# Altium schematic sheet [03] - OV2640.SchDoc
size A3; DocumentNumber: 2; SheetNumber: 2; SheetTotal: 4
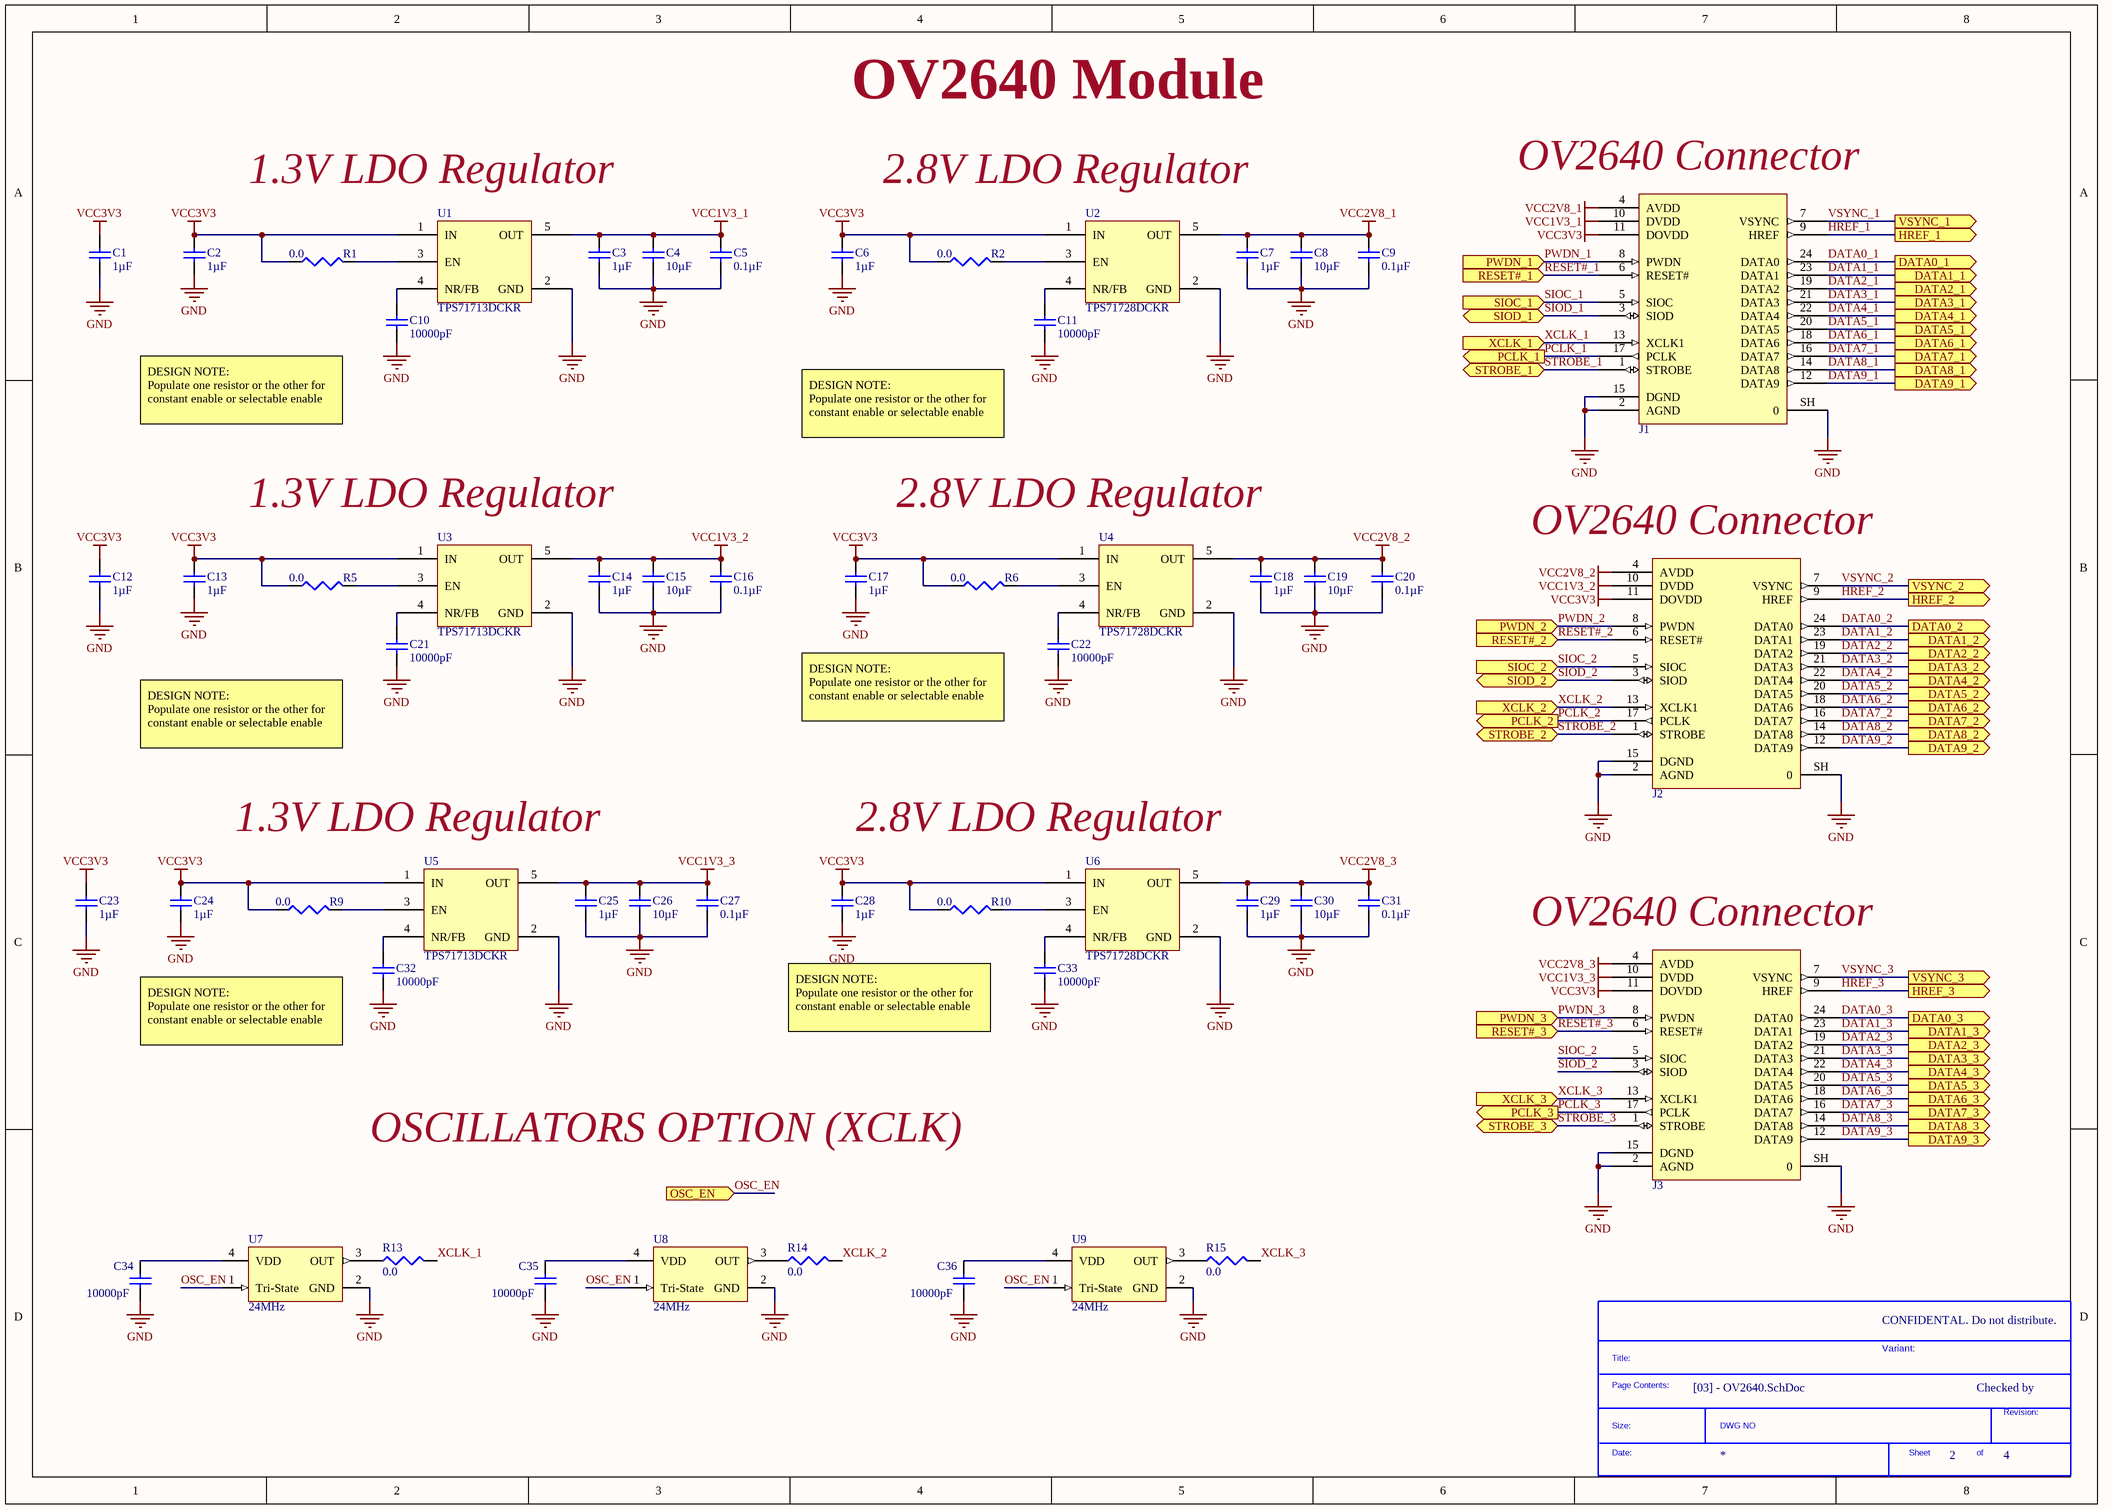
[diagram p0: [03] - OV2640.SchDoc]

## Parts
*  SDTitleBlock  (value not drawn)  (graphical)
C1  Capacitance: 1µF  [CAP-0603]  (hidden comment: GRM188R71C105KA12D)
C2  Capacitance: 1µF  [CAP-0603]  (hidden comment: GRM188R71C105KA12D)
C3  Capacitance: 1µF  [CAP-0603]  (hidden comment: GRM188R71C105KA12D)
C4  Capacitance: 10µF  [CAP-0805]  (hidden comment: GRM21BR61E106KA73L)
C5  Capacitance: 0.1µF  [CAP-0603]  (hidden comment: GRM188R71C104KA01D)
C6  Capacitance: 1µF  [CAP-0603]  (hidden comment: GRM188R71C105KA12D)
C7  Capacitance: 1µF  [CAP-0603]  (hidden comment: GRM188R71C105KA12D)
C8  Capacitance: 10µF  [CAP-0805]  (hidden comment: GRM21BR61E106KA73L)
C9  Capacitance: 0.1µF  [CAP-0603]  (hidden comment: GRM188R71C104KA01D)
C10  Capacitance: 10000pF  [CAP-0603]  (hidden comment: GRM188R71E103KA01D)
C11  Capacitance: 10000pF  [CAP-0603]  (hidden comment: GRM188R71E103KA01D)
C12  Capacitance: 1µF  [CAP-0603]  (hidden comment: GRM188R71C105KA12D)
C13  Capacitance: 1µF  [CAP-0603]  (hidden comment: GRM188R71C105KA12D)
C14  Capacitance: 1µF  [CAP-0603]  (hidden comment: GRM188R71C105KA12D)
C15  Capacitance: 10µF  [CAP-0805]  (hidden comment: GRM21BR61E106KA73L)
C16  Capacitance: 0.1µF  [CAP-0603]  (hidden comment: GRM188R71C104KA01D)
C17  Capacitance: 1µF  [CAP-0603]  (hidden comment: GRM188R71C105KA12D)
C18  Capacitance: 1µF  [CAP-0603]  (hidden comment: GRM188R71C105KA12D)
C19  Capacitance: 10µF  [CAP-0805]  (hidden comment: GRM21BR61E106KA73L)
C20  Capacitance: 0.1µF  [CAP-0603]  (hidden comment: GRM188R71C104KA01D)
C21  Capacitance: 10000pF  [CAP-0603]  (hidden comment: GRM188R71E103KA01D)
C22  Capacitance: 10000pF  [CAP-0603]  (hidden comment: GRM188R71E103KA01D)
C23  Capacitance: 1µF  [CAP-0603]  (hidden comment: GRM188R71C105KA12D)
C24  Capacitance: 1µF  [CAP-0603]  (hidden comment: GRM188R71C105KA12D)
C25  Capacitance: 1µF  [CAP-0603]  (hidden comment: GRM188R71C105KA12D)
C26  Capacitance: 10µF  [CAP-0805]  (hidden comment: GRM21BR61E106KA73L)
C27  Capacitance: 0.1µF  [CAP-0603]  (hidden comment: GRM188R71C104KA01D)
C28  Capacitance: 1µF  [CAP-0603]  (hidden comment: GRM188R71C105KA12D)
C29  Capacitance: 1µF  [CAP-0603]  (hidden comment: GRM188R71C105KA12D)
C30  Capacitance: 10µF  [CAP-0805]  (hidden comment: GRM21BR61E106KA73L)
C31  Capacitance: 0.1µF  [CAP-0603]  (hidden comment: GRM188R71C104KA01D)
C32  Capacitance: 10000pF  [CAP-0603]  (hidden comment: GRM188R71E103KA01D)
C33  Capacitance: 10000pF  [CAP-0603]  (hidden comment: GRM188R71E103KA01D)
C34  Capacitance: 10000pF  [CAP-0603]  (hidden comment: GRM188R71E103KA01D)
C35  Capacitance: 10000pF  [CAP-0603]  (hidden comment: GRM188R71E103KA01D)
C36  Capacitance: 10000pF  [CAP-0603]  (hidden comment: GRM188R71E103KA01D)
J1  OV2640 FFC  [ov2640FSL]  (value not drawn)
J2  OV2640 FFC  [ov2640FSL]  (value not drawn)
J3  OV2640 FFC  [ov2640FSL]  (value not drawn)
R1  Resistance (Ohms): 0.0  [R0603]  (hidden comment: ERJ-3GEY0R00V)
R2  Resistance (Ohms): 0.0  [R0603]  (hidden comment: ERJ-3GEY0R00V)
R5  Resistance (Ohms): 0.0  [R0603]  (hidden comment: ERJ-3GEY0R00V)
R6  Resistance (Ohms): 0.0  [R0603]  (hidden comment: ERJ-3GEY0R00V)
R9  Resistance (Ohms): 0.0  [R0603]  (hidden comment: ERJ-3GEY0R00V)
R10  Resistance (Ohms): 0.0  [R0603]  (hidden comment: ERJ-3GEY0R00V)
R13  Resistance (Ohms): 0.0  [R0603]  (hidden comment: ERJ-3GEY0R00V)
R14  Resistance (Ohms): 0.0  [R0603]  (hidden comment: ERJ-3GEY0R00V)
R15  Resistance (Ohms): 0.0  [R0603]  (hidden comment: ERJ-3GEY0R00V)
U1  TPS71713DCKR  [SOT65P210X110-5N]
U2  TPS71728DCKR  [SOT65P210X110-5N]
U3  TPS71713DCKR  [SOT65P210X110-5N]
U4  TPS71728DCKR  [SOT65P210X110-5N]
U5  TPS71713DCKR  [SOT65P210X110-5N]
U6  TPS71728DCKR  [SOT65P210X110-5N]
U7  24MHz  [OSC 4-SMD]
U8  24MHz  [OSC 4-SMD]
U9  24MHz  [OSC 4-SMD]

## Ports
DATA0_1 (out), DATA0_2 (out), DATA0_3 (out), DATA1_1 (out), DATA1_2 (out), DATA1_3 (out), DATA2_1 (out), DATA2_2 (out), DATA2_3 (out), DATA3_1 (out), DATA3_2 (out), DATA3_3 (out), DATA4_1 (out), DATA4_2 (out), DATA4_3 (out), DATA5_1 (out), DATA5_2 (out), DATA5_3 (out), DATA6_1 (out), DATA6_2 (out), DATA6_3 (out), DATA7_1 (out), DATA7_2 (out), DATA7_3 (out), DATA8_1 (out), DATA8_2 (out), DATA8_3 (out), DATA9_1 (out), DATA9_2 (out), DATA9_3 (out), HREF_1 (out), HREF_2 (out), HREF_3 (out), OSC_EN (in), PCLK_1 (out), PCLK_2 (out), PCLK_3 (out), PWDN_1 (in), PWDN_2 (in), PWDN_3 (in), RESET#_1 (in), RESET#_2 (in), RESET#_3 (in), SIOC_1 (in), SIOC_2 (in), SIOD_1 (bidir), SIOD_2 (bidir), STROBE_1 (bidir), STROBE_2 (bidir), STROBE_3 (bidir), VSYNC_1 (out), VSYNC_2 (out), VSYNC_3 (out), XCLK_1 (in), XCLK_2 (in), XCLK_3 (in)

## Nets
GND: C1.2 C2.2 C3.2 C4.2 C5.2 C6.2 C7.2 C8.2 C9.2 C10.2 C11.2 C12.2 C13.2 C14.2 C15.2 C16.2 C17.2 C18.2 C19.2 C20.2 C21.2 C22.2 C23.2 C24.2 C25.2 C26.2 C27.2 C28.2 C29.2 C30.2 C31.2 C32.2 C33.2 C34.2 C35.2 C36.2 J1.2(AGND) J1.15(DGND) J1.SH(0) J2.2(AGND) J2.15(DGND) J2.SH(0) J3.2(AGND) J3.15(DGND) J3.SH(0) U1.2(GND) U2.2(GND) U3.2(GND) U4.2(GND) U5.2(GND) U6.2(GND) U7.2(GND) U8.2(GND) U9.2(GND)
VCC1V3_1: C3.1 C4.1 C5.1 J1.10(DVDD) U1.5(OUT)
VCC1V3_2: C14.1 C15.1 C16.1 J2.10(DVDD) U3.5(OUT)
VCC1V3_3: C25.1 C26.1 C27.1 J3.10(DVDD) U5.5(OUT)
VCC2V8_1: C7.1 C8.1 C9.1 J1.4(AVDD) U2.5(OUT)
VCC2V8_2: C18.1 C19.1 C20.1 J2.4(AVDD) U4.5(OUT)
VCC2V8_3: C29.1 C30.1 C31.1 J3.4(AVDD) U6.5(OUT)
VCC3V3: C1.1 C2.1 C6.1 C12.1 C13.1 C17.1 C23.1 C24.1 C28.1 J1.11(DOVDD) J2.11(DOVDD) J3.11(DOVDD) R1.1 R2.1 R5.1 R6.1 R9.1 R10.1 U1.1(IN) U2.1(IN) U3.1(IN) U4.1(IN) U5.1(IN) U6.1(IN)
DATA0_1: J1.24(DATA0) ; port DATA0_1
DATA0_2: J2.24(DATA0) ; port DATA0_2
DATA0_3: J3.24(DATA0) ; port DATA0_3
DATA1_1: J1.23(DATA1) ; port DATA1_1
DATA1_2: J2.23(DATA1) ; port DATA1_2
DATA1_3: J3.23(DATA1) ; port DATA1_3
DATA2_1: J1.19(DATA2) ; port DATA2_1
DATA2_2: J2.19(DATA2) ; port DATA2_2
DATA2_3: J3.19(DATA2) ; port DATA2_3
DATA3_1: J1.21(DATA3) ; port DATA3_1
DATA3_2: J2.21(DATA3) ; port DATA3_2
DATA3_3: J3.21(DATA3) ; port DATA3_3
DATA4_1: J1.22(DATA4) ; port DATA4_1
DATA4_2: J2.22(DATA4) ; port DATA4_2
DATA4_3: J3.22(DATA4) ; port DATA4_3
DATA5_1: J1.20(DATA5) ; port DATA5_1
DATA5_2: J2.20(DATA5) ; port DATA5_2
DATA5_3: J3.20(DATA5) ; port DATA5_3
DATA6_1: J1.18(DATA6) ; port DATA6_1
DATA6_2: J2.18(DATA6) ; port DATA6_2
DATA6_3: J3.18(DATA6) ; port DATA6_3
DATA7_1: J1.16(DATA7) ; port DATA7_1
DATA7_2: J2.16(DATA7) ; port DATA7_2
DATA7_3: J3.16(DATA7) ; port DATA7_3
DATA8_1: J1.14(DATA8) ; port DATA8_1
DATA8_2: J2.14(DATA8) ; port DATA8_2
DATA8_3: J3.14(DATA8) ; port DATA8_3
DATA9_1: J1.12(DATA9) ; port DATA9_1
DATA9_2: J2.12(DATA9) ; port DATA9_2
DATA9_3: J3.12(DATA9) ; port DATA9_3
HREF_1: J1.9(HREF) ; port HREF_1
HREF_2: J2.9(HREF) ; port HREF_2
HREF_3: J3.9(HREF) ; port HREF_3
OSC_EN: U7.1(Tri-State) U8.1(Tri-State) U9.1(Tri-State) ; port OSC_EN
PCLK_1: J1.17(PCLK) ; port PCLK_1
PCLK_2: J2.17(PCLK) ; port PCLK_2
PCLK_3: J3.17(PCLK) ; port PCLK_3
PWDN_1: J1.8(PWDN) ; port PWDN_1
PWDN_2: J2.8(PWDN) ; port PWDN_2
PWDN_3: J3.8(PWDN) ; port PWDN_3
RESET#_1: J1.6(RESET#) ; port RESET#_1
RESET#_2: J2.6(RESET#) ; port RESET#_2
RESET#_3: J3.6(RESET#) ; port RESET#_3
SIOC_1: J1.5(SIOC) ; port SIOC_1
SIOC_2: J2.5(SIOC) J3.5(SIOC) ; port SIOC_2
SIOD_1: J1.3(SIOD) ; port SIOD_1
SIOD_2: J2.3(SIOD) J3.3(SIOD) ; port SIOD_2
STROBE_1: J1.1(STROBE) ; port STROBE_1
STROBE_2: J2.1(STROBE) ; port STROBE_2
STROBE_3: J3.1(STROBE) ; port STROBE_3
VSYNC_1: J1.7(VSYNC) ; port VSYNC_1
VSYNC_2: J2.7(VSYNC) ; port VSYNC_2
VSYNC_3: J3.7(VSYNC) ; port VSYNC_3
XCLK_1: J1.13(XCLK1) R13.2 ; port XCLK_1
XCLK_2: J2.13(XCLK1) R14.2 ; port XCLK_2
XCLK_3: J3.13(XCLK1) R15.2 ; port XCLK_3
NetC10_1: C10.1 U1.4(NR/FB)
NetC11_1: C11.1 U2.4(NR/FB)
NetC21_1: C21.1 U3.4(NR/FB)
NetC22_1: C22.1 U4.4(NR/FB)
NetC32_1: C32.1 U5.4(NR/FB)
NetC33_1: C33.1 U6.4(NR/FB)
NetC34_1: C34.1 U7.4(VDD)
NetC35_1: C35.1 U8.4(VDD)
NetC36_1: C36.1 U9.4(VDD)
NetR1_2: R1.2 U1.3(EN)
NetR2_2: R2.2 U2.3(EN)
NetR5_2: R5.2 U3.3(EN)
NetR6_2: R6.2 U4.3(EN)
NetR9_2: R9.2 U5.3(EN)
NetR10_2: R10.2 U6.3(EN)
NetR13_1: R13.1 U7.3(OUT)
NetR14_1: R14.1 U8.3(OUT)
NetR15_1: R15.1 U9.3(OUT)

## Notes on the sheet
- OV2640 Module
- (near J1) OV2640 Connector
- 1.3V LDO Regulator
- 2.8V LDO Regulator
- DESIGN NOTE:
  Populate one resistor or the other for constant enable or selectable enable
- (near J2) OV2640 Connector
- (near J3) OV2640 Connector
- (near C32) DESIGN NOTE:
  Populate one resistor or the other for constant enable or selectable enable
- OSCILLATORS OPTION (XCLK)
- CONFIDENTAL. Do not distribute.
- Variant:
- Checked by
- (in symbol SDTitleBlock) Title:; Page Contents:; Revision:; Size:; DWG NO; Date:; Sheet; of

## Library data of the parts
C1-C3 C6 C7 C12-C14 C17 C18 C23-C25 C28 C29 = GRM188R71C105KA12D: CAP CER 1UF 16V X7R 0603; Manufacturer: Murata Electronics North America; Tolerance: ±10%; Supplier 1: Digi-Key; Manufacturer Part Number: GRM188R71C105KA12D; RoHS: RoHS Compliant; Category: Capacitors; Stock 1: 819049; Pricing 1: 1=0.1, 10=0.073, 50=0.0396, 100=0.0336, 250=0.02744, 500=0.02348, 1000=0.0183 (USD); Packaging: Cut Tape (CT); Voltage - Rated: 16V; Temperature Coefficient: X7R; Mounting Type: Surface Mount, MLCC; Operating Temperature: -55°C ~ 125°C; Applications: General Purpose; Ratings: -; Package / Case: 0603 (1608 Metric); Size / Dimension: 0.063" L x 0.031" W (1.60mm x 0.80mm); Height - Seated (Max): -; Thickness (Max): 0.035" (0.90mm); Lead Spacing: -; Features: -; Lead Style: -; ComponentLink1URL: http://www.murata.com/~/media/webrenewal/support/library/catalog/products/capacitor/mlcc/c02e.pdf; ComponentLink1Description: http://www.murata.com/~/media/webrenewal/support/library/catalog/products/capacitor/mlcc/c02e.pdf; Supplier Part Number 1: 490-3900-1-ND
C4 C8 C15 C19 C26 C30 = GRM21BR61E106KA73L: CAP CER 10UF 25V X5R 0805; Manufacturer: Murata Electronics North America; Tolerance: ±10%; Supplier 1: Digi-Key; Manufacturer Part Number: GRM21BR61E106KA73L; RoHS: RoHS Compliant; Category: Capacitors; Stock 1: 242003; Pricing 1: 1=0.2, 10=0.136, 50=0.0826, 100=0.0693 (USD); Packaging: Cut Tape (CT); Voltage - Rated: 25V; Temperature Coefficient: X5R; Mounting Type: Surface Mount, MLCC; Operating Temperature: -55°C ~ 85°C; Applications: General Purpose; Ratings: -; Package / Case: 0805 (2012 Metric); Size / Dimension: 0.079" L x 0.049" W (2.00mm x 1.25mm); Height - Seated (Max): -; Thickness (Max): 0.053" (1.35mm); Lead Spacing: -; Features: -; Lead Style: -; ComponentLink1URL: http://www.murata.com/~/media/webrenewal/support/library/catalog/products/capacitor/mlcc/c02e.pdf; ComponentLink1Description: http://www.murata.com/~/media/webrenewal/support/library/catalog/products/capacitor/mlcc/c02e.pdf; Supplier Part Number 1: 490-5523-1-ND
C5 C9 C16 C20 C27 C31 = GRM188R71C104KA01D: CAP CER 0.1UF 16V X7R 0603; Manufacturer: Murata Electronics North America; Tolerance: ±10%; Supplier 1: Digi-Key; Manufacturer Part Number: GRM188R71C104KA01D; RoHS: RoHS Compliant; Category: Capacitors; Stock 1: 3229528; Pricing 1: 1=0.1, 10=0.019, 50=0.0102, 100=0.0086, 250=0.00704, 500=0.006, 1000=0.00468 (USD); Packaging: Cut Tape (CT); Voltage - Rated: 16V; Temperature Coefficient: X7R; Mounting Type: Surface Mount, MLCC; Operating Temperature: -55°C ~ 125°C; Applications: General Purpose; Ratings: -; Package / Case: 0603 (1608 Metric); Size / Dimension: 0.063" L x 0.031" W (1.60mm x 0.80mm); Height - Seated (Max): -; Thickness (Max): 0.035" (0.90mm); Lead Spacing: -; Features: -; Lead Style: -; ComponentLink1URL: http://www.murata.com/~/media/webrenewal/support/library/catalog/products/capacitor/mlcc/c02e.pdf; ComponentLink1Description: http://www.murata.com/~/media/webrenewal/support/library/catalog/products/capacitor/mlcc/c02e.pdf; Supplier Part Number 1: 490-1532-1-ND
C10 C11 C21 C22 C32-C36 = GRM188R71E103KA01D: CAP CER 10000PF 25V X7R 0603; Manufacturer: Murata Electronics North America; Tolerance: ±10%; Supplier 1: Digi-Key; Manufacturer Part Number: GRM188R71E103KA01D; RoHS: RoHS Compliant; Category: Capacitors; Stock 1: 164488; Pricing 1: 1=0.1, 10=0.023, 50=0.0124, 100=0.0105, 250=0.00856, 500=0.00732, 1000=0.0057 (USD); Packaging: Cut Tape (CT); Voltage - Rated: 25V; Temperature Coefficient: X7R; Mounting Type: Surface Mount, MLCC; Operating Temperature: -55°C ~ 125°C; Applications: General Purpose; Ratings: -; Package / Case: 0603 (1608 Metric); Size / Dimension: 0.063" L x 0.031" W (1.60mm x 0.80mm); Height - Seated (Max): -; Thickness (Max): 0.035" (0.90mm); Lead Spacing: -; Features: -; Lead Style: -; ComponentLink1URL: http://www.murata.com/~/media/webrenewal/support/library/catalog/products/capacitor/mlcc/c02e.pdf; ComponentLink1Description: http://www.murata.com/~/media/webrenewal/support/library/catalog/products/capacitor/mlcc/c02e.pdf; Supplier Part Number 1: 490-1520-1-ND
J1-J3 = 0524372433: CONN FFC BOTTOM 24POS 0.50MM R/A; Manufacturer: Molex, LLC; Flat Flex Type: FFC, FPC; Connector/Contact Type: Contacts, Bottom; Number of Positions: 24; Pitch: 0.020" (0.50mm); FFC, FCB Thickness: 0.30mm; Locking Feature: Slide Lock; Cable End Type: Straight, Tapered; Actuator Material: Polyphenylene Sulfide (PPS), Glass Filled; Voltage Rating: 50V; Material Flammability Rating: UL94 V-0; Current Rating: 0.5A; Supplier 1: Digi-Key; Manufacturer Part Number: 0524372433; RoHS: RoHS Compliant; Category: Connectors, Interconnects; Stock 1: 133; Pricing 1: 1=2.39, 10=2.164, 25=2.032, 50=1.9436, 100=1.8552, 250=1.67848, 500=1.54596 (USD); Packaging: Cut Tape (CT); Mounting Type: Surface Mount, Right Angle; Termination: Solder; Height Above Board: 0.079" (2.00mm); Contact Material: Phosphor Bronze; Contact Finish: Tin Bismuth; Housing Material: Polyamide (PA), Nylon, Glass Filled; Features: Solder Retention, Zero Insertion Force (ZIF); Operating Temperature: -40°C ~ 85°C; ComponentLink1URL: http://www.molex.com/pdm_docs/sd/524372433_sd.pdf; ComponentLink1Description: http://www.molex.com/pdm_docs/sd/524372433_sd.pdf; Supplier Part Number 1: WM10976CT-ND
R1 R2 R5 R6 R9 R10 R13-R15 = ERJ-3GEY0R00V: RES SMD 0.0OHM JUMPER 1/10W 0603; Manufacturer: Panasonic Electronic Components; Power (Watts): 0.1W, 1/10W; Supplier 1: Digi-Key; Manufacturer Part Number: ERJ-3GEY0R00V; RoHS: RoHS Compliant; Category: Resistors; Stock 1: 7608993; Pricing 1: 1=0.1, 50=0.0126, 100=0.0096, 250=0.00716, 500=0.00528, 1000=0.00352, 2500=0.00297 (USD); Packaging: Cut Tape (CT); Tolerance: Jumper; Composition: Thick Film; Features: Automotive AEC-Q200; Temperature Coefficient: -; Operating Temperature: -55°C ~ 155°C; Package / Case: 0603 (1608 Metric); Supplier Device Package: 0603; Size / Dimension: 0.063" L x 0.031" W (1.60mm x 0.80mm); Height: 0.022" (0.55mm); Number of Terminations: 2; ComponentLink1URL: http://industrial.panasonic.com/www-cgi/jvcr13pz.cgi?E+PZ+3+AOA0001+ERJ3GEY0R00V+7+WW; ComponentLink1Description: http://industrial.panasonic.com/www-cgi/jvcr13pz.cgi?E+PZ+3+AOA0001+ERJ3GEY0R00V+7+WW; Supplier Part Number 1: P0.0GCT-ND
U1 U3 U5 = TPS71713DCKR: IC REG LDO 1.3V 0.15A SC70-5; Manufacturer: Texas Instruments; Regulator Topology: Positive Fixed; Current - Output: 150mA; Number of Regulators: 1; Voltage - Input: 2.5 V ~ 6.5 V; Current - Limit (Min): 200mA; Supplier 1: Digi-Key; Manufacturer Part Number: TPS71713DCKR; RoHS: RoHS Compliant; Category: Integrated Circuits (ICs); Stock 1: 590; Pricing 1: 1=1.1, 10=0.985, 100=0.7679, 500=0.63504, 1000=0.405 (USD); Packaging: Cut Tape (CT); Voltage - Output: 1.3V; Voltage - Dropout (Typical): -; Operating Temperature: -40°C ~ 125°C; Mounting Type: Surface Mount; Package / Case: 5-TSSOP, SC-70-5, SOT-353; Supplier Device Package: SC-70-5; ComponentLink1URL: http://www.ti.com/lit/ds/symlink/tps717.pdf; ComponentLink1Description: http://www.ti.com/lit/ds/symlink/tps717.pdf; Supplier Part Number 1: 296-21350-1-ND
U2 U4 U6 = TPS71728DCKR: IC REG LDO 2.8V 0.15A SC70-5; Manufacturer: Texas Instruments; Regulator Topology: Positive Fixed; Current - Output: 150mA; Voltage - Dropout (Typical): 0.17V @ 150mA; Number of Regulators: 1; Voltage - Input: Up to 6.5V; Current - Limit (Min): 200mA; Supplier 1: Digi-Key; Manufacturer Part Number: TPS71728DCKR; RoHS: RoHS Compliant; Category: Integrated Circuits (ICs); Stock 1: 2440; Pricing 1: 1=1.1, 10=0.985, 100=0.7679, 500=0.63504, 1000=0.405 (USD); Packaging: Cut Tape (CT); Voltage - Output: 2.8V; Operating Temperature: -40°C ~ 125°C; Mounting Type: Surface Mount; Package / Case: 5-TSSOP, SC-70-5, SOT-353; Supplier Device Package: SC-70-5; ComponentLink1URL: http://www.ti.com/lit/ds/symlink/tps717.pdf; ComponentLink1Description: http://www.ti.com/lit/ds/symlink/tps717.pdf; Supplier Part Number 1: 296-19650-1-ND
U7-U9 = ASFL1-24.000MHZ-EC-T: OSC XO 24.000MHZ HCMOS TTL SMD; Manufacturer: Abracon LLC; Function: Tri-State (Output Enable); Output: HCMOS, TTL; Voltage - Supply: 3.3V; Frequency Stability: ±50ppm; Current - Supply (Max): 15mA; Current - Supply (Disable) (Max): 10µA; Supplier 1: Digi-Key; Manufacturer Part Number: ASFL1-24.000MHZ-EC-T; RoHS: RoHS Compliant; Category: Crystals and Oscillators; Stock 1: 5040; Pricing 1: 1=1.25, 10=1.198, 50=1.1714, 100=1.0017, 500=0.9752 (USD); Packaging: Cut Tape (CT); Type: XO (Standard); Frequency: 24MHz; Operating Temperature: -20°C ~ 70°C; Ratings: -; Mounting Type: Surface Mount; Size / Dimension: 0.197" L x 0.126" W (5.00mm x 3.20mm); Height: 0.051" (1.30mm); Package / Case: 4-SMD, No Lead (DFN, LCC); ComponentLink1URL: http://www.abracon.com/Oscillators/ASFL1.pdf; ComponentLink1Description: http://www.abracon.com/Oscillators/ASFL1.pdf; Supplier Part Number 1: 300-8252-1-ND